# EAGLE design week5 (EAGLE 6.5.0)
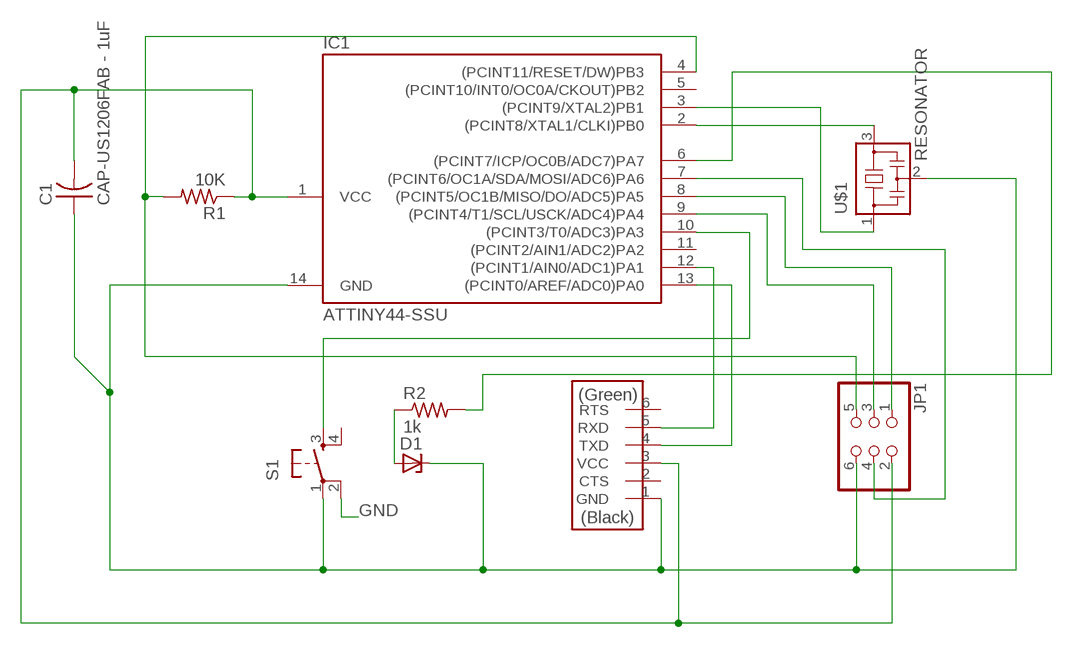
[diagram p0: schematic, sheet 1]

## Parts
C1  CAP-US1206FAB - 1uF  CAP-US1206FAB  [C1206FAB]
D1  ZENER_DIODESOD123  [SOD123]
IC1  ATTINY44-SSU  [SOIC14]
JP1  PINHD-2X3-SMD  [2X03SMD]
R1  10K  RES-US1206  [R1206]
R2  1k  RES-US1206FAB  [R1206FAB]
S1  6MM_SWITCH6MM_SWITCH  [6MM_SWITCH]
U$1  RESONATOR  [EFOBM]
U$2  FTDI-SMD-HEADER  [1X06SMD]

## Nets
GND: C1.1 D1.CATHODE IC1.14(GND) JP1.6 S1.1(P) S1.2(P1) U$1.2 U$2.1(GND)
N$1: D1.ANODE R2.1
N$2: IC1.2((PCINT8/XTAL1/CLKI)PB0) U$1.3
N$3: IC1.3((PCINT9/XTAL2)PB1) U$1.1
N$4: C1.2 IC1.1(VCC) JP1.2 R1.1 U$2.3(VCC)
N$5: IC1.4((PCINT11/RESET/DW)PB3) JP1.5 R1.2
N$6: IC1.8((PCINT5/OC1B/MISO/DO/ADC5)PA5) JP1.1
N$7: IC1.9((PCINT4/T1/SCL/USCK/ADC4)PA4) JP1.3
N$8: IC1.10((PCINT3/T0/ADC3)PA3) S1.3(S)
N$9: IC1.7((PCINT6/OC1A/SDA/MOSI/ADC6)PA6) JP1.4
N$10: IC1.6((PCINT7/ICP/OC0B/ADC7)PA7) R2.2
N$11: IC1.13((PCINT0/AREF/ADC0)PA0) U$2.4(TXD)
N$12: IC1.12((PCINT1/AIN0/ADC1)PA1) U$2.5(RXD)
Unconnected: IC1.5((PCINT10/INT0/OC0A/CKOUT)PB2) IC1.11((PCINT2/AIN1/ADC2)PA2) S1.4(S1) U$2.2(CTS) U$2.6(RTS)

## Library data of the parts
C1 = fab:CAP-US
D1 = fab 2:ZENER_DIODE: zener diode
IC1 = fab:ATTINY44
JP1 = fab:PINHD-2X3-SMD: PIN HEADER
R1 R2 = fab:RES-US: Resistor (US Symbol) Variants with postfix FAB are widened to allow the routing of internal traces
S1 = fab:6MM_SWITCH: OMRON SWITCH
U$1 = fab:RESONATOR
U$2 = fab:FTDI-SMD-HEADER

## Net classes
0 default: clearance 0.205 mm

## Board
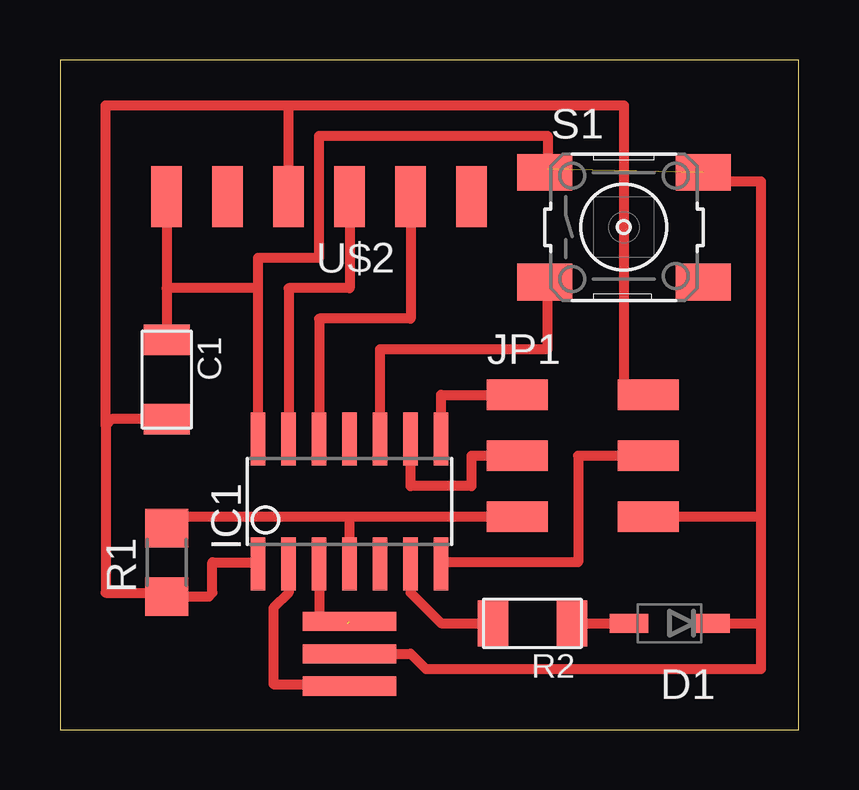
[diagram p1: board, top side]

Size 30.79 x 27.93 mm. Coordinates in mm from the lower left corner, seen from the top.
Outline: 0,0 30.79,0 30.79,27.93 0,27.93 0,0
Copper layers (1*16): Top 0.035mm / dielectric 1.5mm / Bottom 0.035mm
Design rules "default": minimum track width 10mil, minimum drill 24mil, track to track 8mil, track to pad 8mil, pad to pad 8mil, via to via 8mil, smd to smd 8mil, copper to edge 40mil, drill to drill 8mil, minimum pad ring 10mil, minimum via ring 8mil, stop-mask expansion 4mil, vias tented up to drill 0mil, thermal gap 10mil

### Footprints (pad centres in the part's own frame; a part is rotated, then mirrored left to right if it is on the bottom)
C1206FAB = smd 1.27 x 1.905: 1 -1.651,0; 2 1.651,0
SOD123 = smd 1.6 x 0.8: ANODE 1.7,0; CATHODE -1.7,0
SOIC14 = smd 0.61 x 2.21: 1 -3.81,-2.603; 2 -2.54,-2.603; 3 -1.27,-2.603; 4 0,-2.603; 5 1.27,-2.603; 6 2.54,-2.603; 7 3.81,-2.603; 8 3.81,2.603; 9 2.54,2.603; 10 1.27,2.603; 11 0,2.603; 12 -1.27,2.603; 13 -2.54,2.603; 14 -3.81,2.603
2X03SMD = smd 2.54 x 1.27: 1 -2.54,2.54; 2 2.92,2.54; 3 -2.54,0; 4 2.92,0; 5 -2.54,-2.54; 6 2.92,-2.54
R1206 = smd 1.6 x 1.803: 1 -1.422,0; 2 1.422,0
R1206FAB = smd 1.27 x 1.905: 1 -1.651,0; 2 1.651,0
6MM_SWITCH = smd 2.286 x 1.524: 1 -3.302,2.286; 2 3.302,2.286; 3 -3.302,-2.286; 4 3.302,-2.286
EFOBM = smd 0.8 x 3.9: 1 -1.35,0; 2 0,0; 3 1.35,0
1X06SMD = smd 2.54 x 1.27: 1 0,6.35; 2 0,3.81; 3 0,1.27; 4 0,-1.27; 5 0,-3.81; 6 0,-6.35

### Placement (x,y rotation side)
C1  4.45,14.61 270 top
D1  25.4,4.45 180 top
IC1  12.06,9.53 0 top
JP1  21.59,11.43 0 top
R1  4.45,6.99 90 top
R2  19.68,4.45 180 top
S1  23.5,20.95 0 top
U$1  12.06,3.17 270 top
U$2  10.79,22.23 90 top

### Tracks (layer width: path | path; a pad name or v marks a point on that pad's centre or on a via)
GND  (1 unrouted)
  Top 0.406: IC1.14 8.26,18.41 | 8.26,18.41 4.45,18.41 | 4.45,18.41 C1.1 | U$2.1 4.45,18.41 | 8.26,18.41 8.26,19.68 10.79,19.68 10.79,24.77 20.32,24.77 20.32,23.37 S1.1 | JP1.6 29.21,8.89 | 29.21,8.89 29.21,22.86 27.18,22.86 S1.2 | U$1.2 14.61,3.17 15.24,2.54 29.21,2.54 29.21,4.45 | 29.21,4.45 29.21,8.89 | D1.CATHODE 29.21,4.45
N$1
  Top 0.406: R2.1 D1.ANODE
N$2
  Top 0.406: IC1.2 9.53,5.71 8.89,5.08 8.89,1.91 11.98,1.91 U$1.3
N$3  (1 unrouted)
  Top 0.406: IC1.3 10.79,4.45 11.98,4.45
N$4
  Top 0.406: IC1.1 8.19,6.99 6.35,6.99 6.35,5.71 6.2,5.56 R1.1 4.29,5.71 1.91,5.71 1.91,12.7 | C1.2 2.16,12.95 1.91,12.7 | 1.91,12.7 1.91,26.04 9.53,26.04 | U$2.3 9.53,26.04 | 9.53,26.04 23.5,26.04 23.5,13.97 JP1.2
N$5
  Top 0.406: 12.06,8.89 4.45,8.89 R1.2 | 12.06,8.89 JP1.5 | IC1.4 12.06,8.89
N$6
  Top 0.406: IC1.8 15.88,13.97 JP1.1
N$7
  Top 0.406: JP1.3 17.14,11.43 17.14,10.16 14.61,10.16 IC1.9
N$8
  Top 0.406: IC1.10 13.34,15.88 20.32,15.88 20.32,18.54 S1.3
N$9
  Top 0.406: JP1.4 21.59,11.43 21.59,6.99 15.94,6.99 IC1.7
N$10
  Top 0.406: IC1.6 14.61,5.71 15.88,4.45 R2.2
N$11
  Top 0.406: U$2.4 12.06,18.41 9.53,18.41 IC1.13
N$12
  Top 0.406: U$2.5 14.61,17.14 10.79,17.14 IC1.12